# EAGLE design Nanite 85 SS V2 (EAGLE 6.6.0)
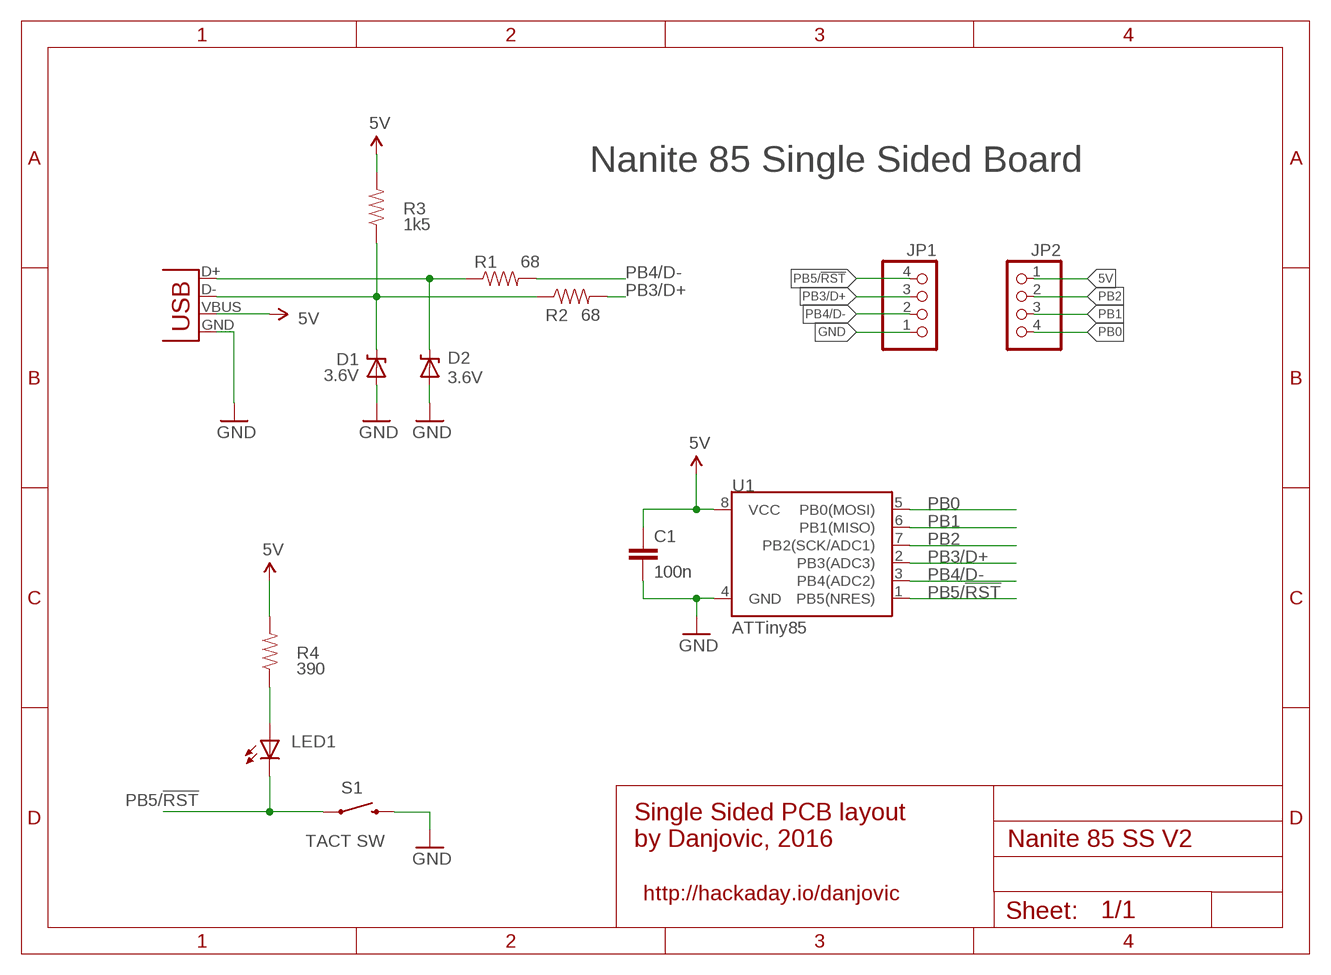
[diagram p0: schematic, sheet 1]

## Parts
C1  100n  CAPKIT  [CAP-PTH-SMALL-KIT]
D1  3.6V  DIODE-ZENERPTH  [DIODE-ZENER]
D2  3.6V  DIODE-ZENERPTH  [DIODE-ZENER]
JP1  HEADER-1X4ROUND  [1X04_ROUND]
JP2  HEADER-1X4ROUND  [1X04_ROUND]
JP4  USB-B  USBPTH  [USB-B-PTH]
LED1  LED3MM  [LED3MM]
R1  68  RESISTORAXIAL-0.3  [AXIAL-0.3]
R2  68  RESISTOREZ  [AXIAL-0.3EZ]
R3  1k5  RESISTOREZ  [AXIAL-0.3EZ]
R4  390  RESISTOREZ  [AXIAL-0.3EZ]
S1  TACT SW  SWITCH-MOMENTARY-2PTH  [TACTILE-PTH]
U1  ATTiny85  ATTINY45TINY45-20-DIP  [DIP08]

## Nets
5V [Power]: C1.1 JP2.1 JP4.VBUS R3.P$2 R4.P$2 U1.8(VCC)
GND [Power]: C1.2 D1.P$2(A) D2.P$2(A) JP1.1 JP4.GND S1.3 U1.4(GND)
N$3: LED1.A R4.P$1
PB0: JP2.4 U1.5(PB0(MOSI))
PB1: JP2.3 U1.6(PB1(MISO))
PB2: JP2.2 U1.7(PB2(SCK/ADC1))
PB3/D+: JP1.3 R2.P$2 U1.2(PB3(ADC3))
PB4/D-: JP1.2 R1.P$2 U1.3(PB4(ADC2))
PB5/!RST: JP1.4 LED1.K(C) S1.1 U1.1(PB5(NRES))
USB_D+: D2.P$1(C) JP4.D+ R1.P$1
USB_D-: D1.P$1(C) JP4.D- R2.P$1 R3.P$1

## Notes on the sheet
- Nanite 85 Single Sided Board
- Single Sided PCB layout
  by Danjovic, 2016
- http://hackaday.io/danjovic

## Library data of the parts
C1 = SparkFun-Capacitors:CAP: Capacitor Standard 0603 ceramic capacitor, and 0.1" leaded capacitor.
D1 D2 = SparkFun-DiscreteSemi:DIODE-ZENER: Zener Diode Production Part - 8199 3.4V Zener Voltage
JP1 JP2 = microbuilder:HEADER-1X4: PIN HEADER
JP4 = SparkFun-Connectors_tb:USB: USB Connectors USB-B-PTH is fully proven SKU : PRT-00139/CONN-08278 USB-miniB is fully proven SKU : PRT-00587 USB-A-PCB is untested. USB-A-H is throughly reviewed, but untested. Spark Fun Electronics SKU : PRT-00437 USB-B-SMT is throughly reviewed, but untested. Needs silkscreen touching up. USB-A-S has not been used/tested USB-MB-H has not been used/tested USB-MICROB has been used. CONN-09505; PROD_ID: CONN-08278
LED1 = led:LED: LED OSRAM: - CHIPLED LG R971, LG N971, LY N971, LG Q971, LY Q971, LO R971, LY R971 LH N974, LH R974 LS Q976, LO Q976, LY Q976 LO Q996 - Hyper CHIPLED LW Q18S LB Q993, LB Q99A, LB R99A - SideLED LS A670, LO A670, LY A670, LG A670, LP A670 LB A673, LV A673, LT A673, LW A673 LH A674 LY A675 LS A676, LA A676, LO A676, LY A676, LW A676 LS A679, LY A679, LG A679 - Hyper Micro SIDELED® LS Y876, LA Y876, LO Y876, LY Y876 LT Y87S - SmartLED LW L88C, LW L88S LB L89C, LB L89S, LG L890 LS L89K, LO L89K, LY L89K LS L896, LA L896, LO L896, LY L896 - TOPLED LS T670, LO T670, LY T670, LG T670, LP T670 LSG T670, LSP T670, LSY T670, LOP T670, LYG T670 LG T671, LOG T671, LSG T671 LB T673, LV T673, LT T673, LW T673 LH T674 LS T676, LA T676, LO T676, LY T676, LB T676, LH T676, LSB T676, LW T676 LB T67C, LV T67C, LT T67C, LS T67K, LO T67K, LY T67K, LW E67C LS E67B, LA E67B, LO E67B, LY E67B, LB E67C, LV E67C, LT E67C LW T67C LS T679, LY T679, LG T679 LS T770, LO T770, LY T770, LG T770, LP T770 LB T773, LV T773, LT T773, LW T773 LH T774 LS E675, LA E675, LY E675, LS T675 LS T776, LA T776, LO T776, LY T776, LB T776 LHGB T686 LT T68C, LB T68C - Hyper Mini TOPLED® LB M676 - Mini TOPLED Santana® LG M470 LS M47K, LO M47K, LY M47K Source: http://www.osram.convergy.de LUXEON: - LUMILED® LXK2-PW12-R00, LXK2-PW12-S00, LXK2-PW14-U00, LXK2-PW14-V00 LXK2-PM12-R00, LXK2-PM12-S00, LXK2-PM14-U00 LXK2-PE12-Q00, LXK2-PE12-R00, LXK2-PE12-S00, LXK2-PE14-T00, LXK2-PE14-U00 LXK2-PB12-K00, LXK2-PB12-L00, LXK2-PB12-M00, LXK2-PB14-N00, LXK2-PB14-P00, LXK2-PB14-Q00 LXK2-PR12-L00, LXK2-PR12-M00, LXK2-PR14-Q00, LXK2-PR14-R00 LXK2-PD12-Q00, LXK2-PD12-R00, LXK2-PD12-S00 LXK2-PH12-R00, LXK2-PH12-S00 LXK2-PL12-P00, LXK2-PL12-Q00, LXK2-PL12-R00 Source: www.luxeon.com KINGBRIGHT: KA-3528ASYC Source: www.kingbright.com
R1-R4 = SparkFun-Passives:RESISTOR: Resistor Basic schematic elements and footprints for 0603, 1206, and PTH resistors.
S1 = SparkFun-Electromechanical:SWITCH-MOMENTARY-2: Various NO switches- pushbuttons, reed, etc
U1 = SparkFun-DigitalIC:ATTINY45: Atmel 8-pin 2/4/8kB flash uC; PROD_ID: IC-09439; VALUE: TINY45-20-DIP

## Net classes
0 default: width 0.254 mm, clearance 0.152 mm
1 Power: width 0.254 mm, clearance 0.152 mm

## Board
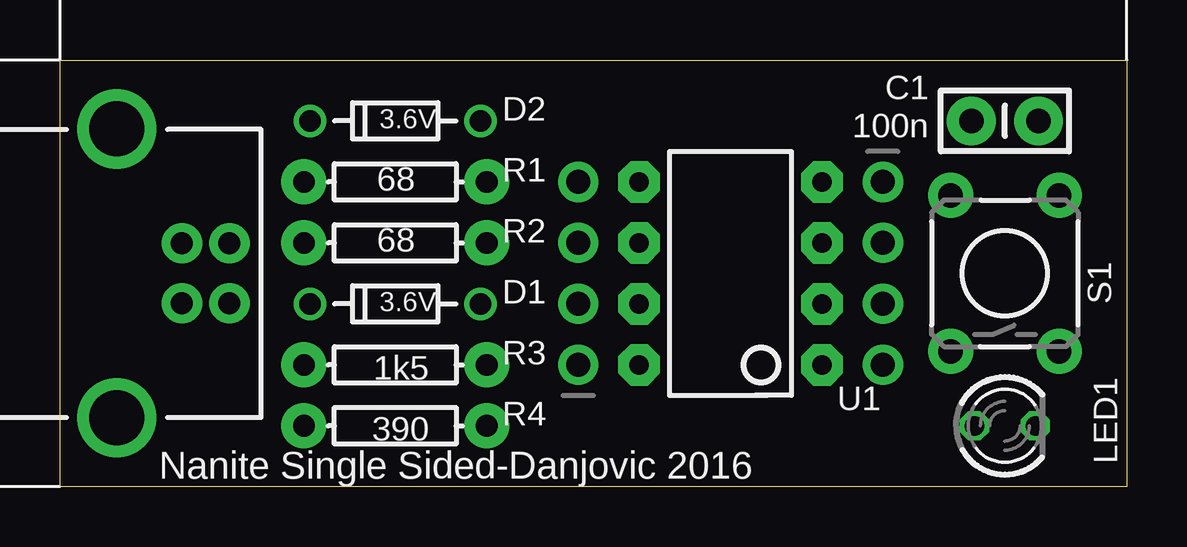
[diagram p1: board, top side]
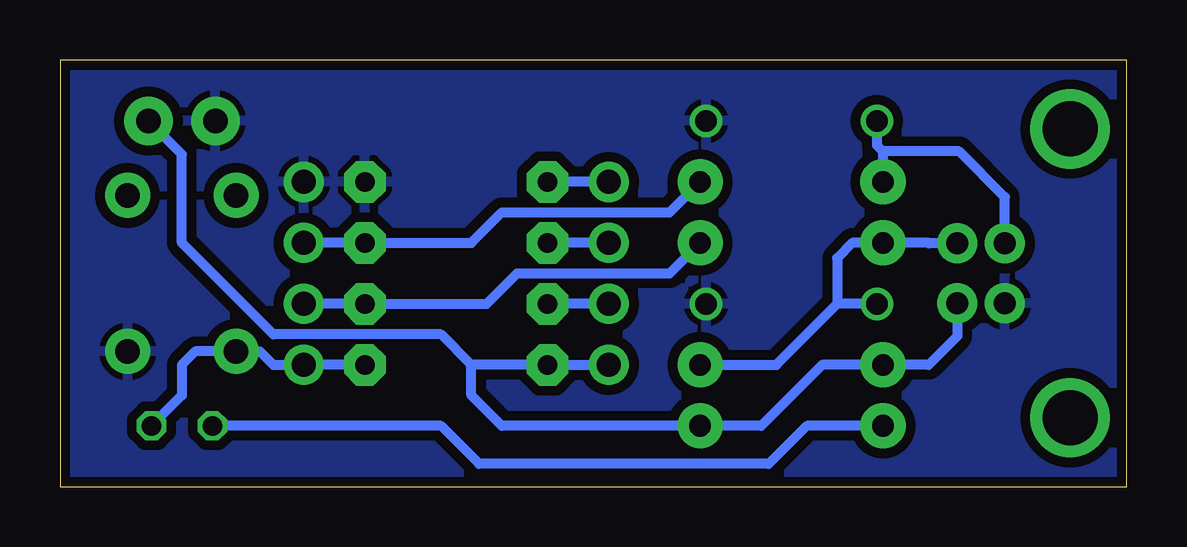
[diagram p2: board, bottom side, seen from below]

Size 44.45 x 17.78 mm. Coordinates in mm from the lower left corner, seen from the top.
Outline: 0,0 0,17.78 44.45,17.78 44.45,0 0,0
Copper layers (1*16): Top 0.0356mm / dielectric 1.5011mm / Bottom 0.0356mm
Design rules "LaenPCBOrder *": minimum track width 6mil, minimum drill 13mil, track to track 6mil, track to pad 6mil, pad to pad 6mil, via to via 6mil, smd to smd 6mil, copper to edge 15mil, drill to drill 6mil, minimum pad ring 7mil, minimum via ring 7mil, stop-mask expansion 4mil, vias tented up to drill 0mil, thermal gap 10mil

### Footprints (pad centres in the part's own frame; a part is rotated, then mirrored left to right if it is on the bottom)
CAP-PTH-SMALL-KIT = drill 1.016 pad 2.032: 1 -1.397,0; 2 1.397,0
DIODE-ZENER = drill 0.9: P$1 -3.556,0; P$2 3.556,0
1X04_ROUND = drill 1 pad 1.676: 1 -3.81,0; 2 -1.27,0; 3 1.27,0; 4 3.81,0
USB-B-PTH = drill 0.914 pad 1.676: D+ 0,1.25; D- 1.981,1.25; GND 0,-1.25; VBUS 1.981,-1.25 | drill 2.286: S1 -2.718,-6.02; S2 -2.718,6.02
LED3MM = drill 0.813 octagon: A -1.27,0; K 1.27,0
AXIAL-0.3 = drill 0.9 pad 1.88: P$1 -3.81,0; P$2 3.81,0
AXIAL-0.3EZ = drill 0.9 pad 1.88: P$1 -3.81,0; P$2 3.81,0
TACTILE-PTH = drill 1.016 pad 1.88: 1 -3.251,2.261; 2 3.251,2.261; 3 -3.251,-2.261; 4 3.251,-2.261
DIP08 = drill 0.813 pad 1.727 octagon: 1 -3.81,-3.81; 2 -1.27,-3.81; 3 1.27,-3.81; 4 3.81,-3.81; 5 3.81,3.81; 6 1.27,3.81; 7 -1.27,3.81; 8 -3.81,3.81

### Placement (x,y rotation side)
C1  39.37,15.24 180 top
D1  13.97,7.62 0 top
D2  13.97,15.24 0 top
JP1  34.29,8.89 270 top
JP2  21.59,8.89 90 top
JP4  5.08,8.89 0 top
LED1  39.37,2.54 0 top
R1  13.97,12.7 0 top
R2  13.97,10.16 0 top
R3  13.97,5.08 180 top
R4  13.97,2.54 0 top
S1  39.37,8.89 90 top
U1  27.94,8.89 90 top

### Tracks (layer width: path | path; a pad name or v marks a point on that pad's centre or on a via)
5V
  Bottom 0.406: JP2.1 U1.8 27.3,5.08 | 27.3,5.08 28.57,6.35 35.56,6.35 39.37,10.16 39.37,13.84 C1.1 | 27.3,5.08 27.3,3.81 26.04,2.54 R4.P$2 15.24,2.54 12.7,5.08 R3.P$2 8.26,5.08 7.06,6.27 JP4.VBUS
GND
  pour Bottom (isolate 0.406): 0,17.78 44.45,17.78 44.45,0 0,0
N$3
  Bottom 0.406: LED1.A 28.57,2.54 26.99,0.95 14.92,0.95 13.34,2.54 R4.P$1
PB0
  Bottom 0.406: JP2.4 U1.5
PB1
  Bottom 0.406: JP2.3 U1.6
PB2
  Bottom 0.406: JP2.2 U1.7
PB3/D+
  Bottom 0.406: JP1.3 U1.2 26.67,7.62 25.4,8.89 19.05,8.89 R2.P$2
PB4/D-
  Bottom 0.406: JP1.2 U1.3 27.3,10.16 26.04,11.43 19.05,11.43 R1.P$2
PB5/!RST
  Bottom 0.406: U1.1 JP1.4 35.56,5.08 36.12,5.64 S1.1 38.81,5.64 39.37,5.08 39.37,3.81 LED1.K
USB_D+
  Bottom 0.406: JP4.D+ 5.08,12.06 6.99,13.97 10.16,13.97 | 10.16,13.97 R1.P$1 | D2.P$1 10.41,14.22 10.16,13.97
USB_D-
  Bottom 0.406: R3.P$1 14.61,5.08 12.06,7.62 | 12.06,7.62 12.06,9.53 11.43,10.16 R2.P$1 8.26,10.16 8.23,10.14 JP4.D- | D1.P$1 12.06,7.62

### Text on the board
tPlace: C1 | 100n | Nanite Single Sided-Danjovic 2016